# Altium schematic sheet Sheet3.SchDoc
size 420 x 297 mm
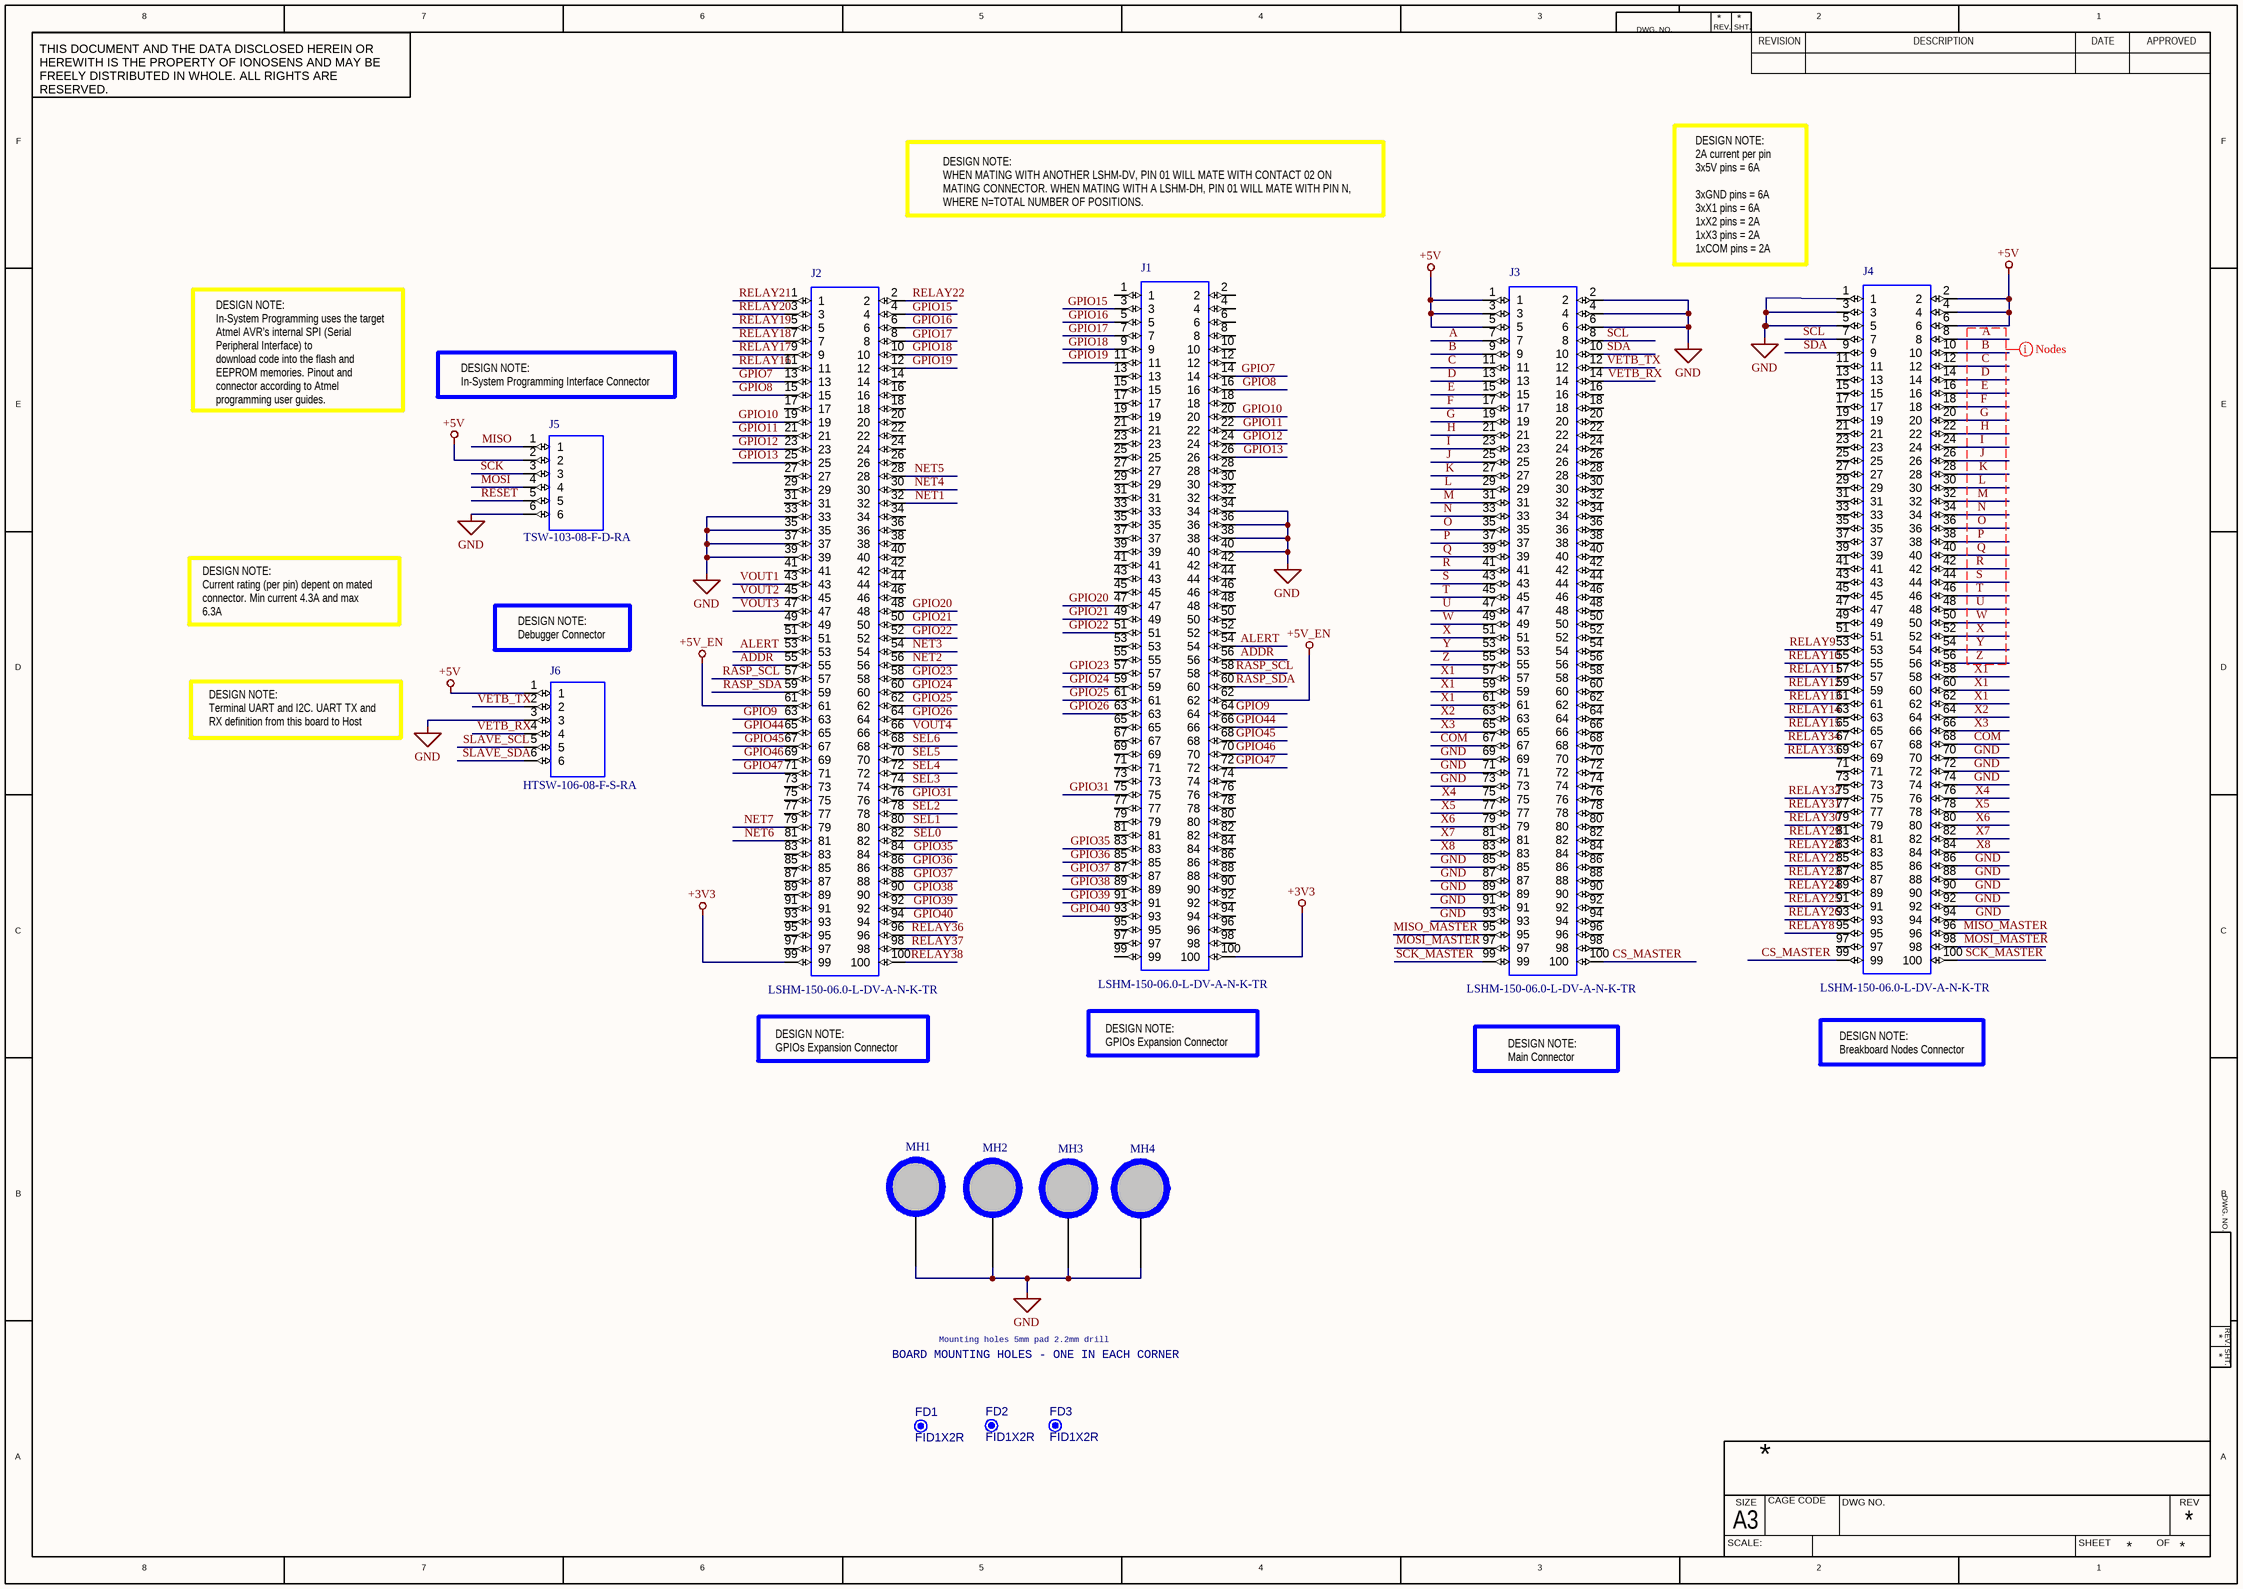
[diagram p0: Sheet3.SchDoc]

## Parts
FD1  FID1X2R  [FID1X2R]  (no BOM)
FD2  FID1X2R  [FID1X2R]  (no BOM)
FD3  FID1X2R  [FID1X2R]  (no BOM)
J1  LSHM-150-06.0-L-DV-A-N-K-TR  [LSHM_150_06_0_L_DV_A_N_K_TR]
J2  LSHM-150-06.0-L-DV-A-N-K-TR  [LSHM_150_06_0_L_DV_A_N_K_TR]
J3  LSHM-150-06.0-L-DV-A-N-K-TR  [LSHM_150_06_0_L_DV_A_N_K_TR]
J4  LSHM-150-06.0-L-DV-A-N-K-TR  [LSHM_150_06_0_L_DV_A_N_K_TR]
J5  TSW-103-08-F-D-RA  [TSW-103-08-F-D-RA]
J6  HTSW-106-08-F-S-RA  [TSW-106-08-F-S-RA]
MH1  C500h220  [C500h220z368]  (value not drawn)
MH2  C500h220  [C500h220z368]  (value not drawn)
MH3  C500h220  [C500h220z368]  (value not drawn)
MH4  C500h220  [C500h220z368]  (value not drawn)

## Nets
+3V3: J1.100 J2.99
+5V: J3.1 J3.3 J3.5 J4.2 J4.4 J4.6 J5.2 J6.1
+5V_EN: J1.62 J2.61
GND: J1.34 J1.36 J1.38 J1.40 J2.33 J2.35 J2.37 J2.39 J3.2 J3.4 J3.6 J3.69 J3.71 J3.73 J3.85 J3.87 J3.89 J3.91 J3.93 J4.1 J4.3 J4.5 J4.70 J4.72 J4.74 J4.86 J4.88 J4.90 J4.92 J4.94 J5.6 J6.3 MH1.1 MH2.1 MH3.1 MH4.1
A: J3.7 J4.8
ADDR: J1.56 J2.55
ALERT: J1.54 J2.53
B: J3.9 J4.10
C: J3.11 J4.12
COM: J3.67 J4.68
CS_MASTER: J3.100 J4.99
D: J3.13 J4.14
E: J3.15 J4.16
F: J3.17 J4.18
G: J3.19 J4.20
GPIO7: J1.14 J2.13
GPIO8: J1.16 J2.15
GPIO9: J1.64 J2.63
GPIO10: J1.20 J2.19
GPIO11: J1.22 J2.21
GPIO12: J1.24 J2.23
GPIO13: J1.26 J2.25
GPIO15: J1.3 J2.4
GPIO16: J1.5 J2.6
GPIO17: J1.7 J2.8
GPIO18: J1.9 J2.10
GPIO19: J1.11 J2.12
GPIO20: J1.47 J2.48
GPIO21: J1.49 J2.50
GPIO22: J1.51 J2.52
GPIO23: J1.57 J2.58
GPIO24: J1.59 J2.60
GPIO25: J1.61 J2.62
GPIO26: J1.63 J2.64
GPIO31: J1.75 J2.76
GPIO35: J1.83 J2.84
GPIO36: J1.85 J2.86
GPIO37: J1.87 J2.88
GPIO38: J1.89 J2.90
GPIO39: J1.91 J2.92
GPIO40: J1.93 J2.94
GPIO44: J1.66 J2.65
GPIO45: J1.68 J2.67
GPIO46: J1.70 J2.69
GPIO47: J1.72 J2.71
H: J3.21 J4.22
I: J3.23 J4.24
J: J3.25 J4.26
K: J3.27 J4.28
L: J3.29 J4.30
M: J3.31 J4.32
MISO: J5.1
MISO_MASTER: J3.95 J4.96
MOSI: J5.4
MOSI_MASTER: J3.97 J4.98
N: J3.33 J4.34
NET1: J2.32
NET2: J2.56
NET3: J2.54
NET4: J2.30
NET5: J2.28
NET6: J2.81
NET7: J2.79
O: J3.35 J4.36
P: J3.37 J4.38
Q: J3.39 J4.40
R: J3.41 J4.42
RASP_SCL: J1.58 J2.57
RASP_SDA: J1.60 J2.59
RELAY8: J4.95
RELAY9: J4.53
RELAY10: J4.55
RELAY11: J4.57
RELAY12: J4.59
RELAY13: J4.61
RELAY14: J4.63
RELAY15: J4.65
RELAY16: J2.11
RELAY17: J2.9
RELAY18: J2.7
RELAY19: J2.5
RELAY20: J2.3
RELAY21: J2.1
RELAY22: J2.2
RELAY23: J4.87
RELAY24: J4.89
RELAY25: J4.91
RELAY26: J4.93
RELAY27: J4.85
RELAY28: J4.83
RELAY29: J4.81
RELAY30: J4.79
RELAY31: J4.77
RELAY32: J4.75
RELAY33: J4.69
RELAY34: J4.67
RELAY36: J2.96
RELAY37: J2.98
RELAY38: J2.100
RESET: J5.5
S: J3.43 J4.44
SCK: J5.3
SCK_MASTER: J3.99 J4.100
SCL: J3.8 J4.7
SDA: J3.10 J4.9
SEL0: J2.82
SEL1: J2.80
SEL2: J2.78
SEL3: J2.74
SEL4: J2.72
SEL5: J2.70
SEL6: J2.68
SLAVE_SCL: J6.5
SLAVE_SDA: J6.6
T: J3.45 J4.46
U: J3.47 J4.48
VETB_RX: J3.14 J6.4
VETB_TX: J3.12 J6.2
VOUT1: J2.43
VOUT2: J2.45
VOUT3: J2.47
VOUT4: J2.66
W: J3.49 J4.50
X: J3.51 J4.52
X1: J3.57 J3.59 J3.61 J4.58 J4.60 J4.62
X2: J3.63 J4.64
X3: J3.65 J4.66
X4: J3.75 J4.76
X5: J3.77 J4.78
X6: J3.79 J4.80
X7: J3.81 J4.82
X8: J3.83 J4.84
Y: J3.53 J4.54
Z: J3.55 J4.56

Not connected (* = marked no-connect by the designer): J1 1 2 4 6 8 10 12 13 15 17 18 19 21 23 25 27 28 29 30 31 32 33 35 37 39 41 42 43 44 45 46 48 50 52 53 55 65 67 69 71 73 74 76 77 78 79 80 81 82 84 86 88 90 92 94 95 96 97 98 99; J2 14 16 17 18 20 22 24 26 27 29 31 34 36 38 40 41 42 44 46 49 51 73 75 77 83 85 87 89 91 93 95 97; J3 16 18 20 22 24 26 28 30 32 34 36 38 40 42 44 46 48 50 52 54 56 58 60 62 64 66 68 70 72 74 76 78 80 82 84 86 88 90 92 94 96 98; J4 11 13 15 17 19 21 23 25 27 29 31 33 35 37 39 41 43 45 47 49 51 71 73 97

## Layout directives
net class Nodes: A, B, C, D, E, F, G, H, I, J, K, L, M, N, O, P, Q, R, S, T, U, W, X, Y, Z

## Notes on the sheet
- DESIGN NOTE:
  WHEN MATING WITH ANOTHER LSHM-DV, PIN 01 WILL MATE WITH CONTACT 02 ON
  MATING CONNECTOR. WHEN MATING WITH A LSHM-DH, PIN 01 WILL MATE WITH PIN N,
  WHERE N=TOTAL NUMBER OF POSITIONS.
- DESIGN NOTE:
  2A current per pin
  3x5V pins = 6A
  3xGND pins = 6A
  3xX1 pins = 6A
  1xX2 pins = 2A
  1xX3 pins = 2A
  1xCOM pins = 2A
- DESIGN NOTE:
  In-System Programming Interface Connector
- DESIGN NOTE:
  In-System Programming uses the target Atmel AVR’s internal SPI (Serial Peripheral Interface) to
  download code into the flash and EEPROM memories. Pinout and connector according to Atmel programming user guides.
- DESIGN NOTE:
  Current rating (per pin) depent on mated connector. Min current 4.3A and max 6.3A
- (near J6) DESIGN NOTE:
  Debugger Connector
- DESIGN NOTE:
  Terminal UART and I2C. UART TX and RX definition from this board to Host
- DESIGN NOTE:
  GPIOs Expansion Connector
- DESIGN NOTE:
  Main Connector
- DESIGN NOTE:
  Breakboard Nodes Connector
- Mounting holes 5mm pad 2.2mm drill
- BOARD MOUNTING HOLES - ONE IN EACH CORNER
- 8
- 7
- 6
- 5
- 4
- 3
- DWG. NO.
- REV.
- SHT.
- REVISION
- 2
- DESCRIPTION
- DATE
- 1
- APPROVED
- THIS DOCUMENT AND THE DATA DISCLOSED HEREIN OR HEREWITH IS THE PROPERTY OF IONOSENS AND MAY BE FREELY DISTRIBUTED IN WHOLE. ALL RIGHTS ARE RESERVED.
- F
- E
- D
- C
- B
- A
- SCALE:
- A3
- SIZE
- CAGE CODE
- DWG NO.
- SHEET
- OF
- REV

## Library data of the parts
FD1-FD3 = CMP-00028-00005-2: Fiducial - Round 1x2mm; Pins: 0
J1-J4 = J01-001-01-00001-2: Conn Socket and Terminal Strip HDR/SKT 100 POS 0.5mm Solder ST SMD T/R; Manufacturer: Samtec; Gender: HERMAPHRODITIC; Pitch: 500 µm; Contact Plating: Gold; Case/Package: SMD; Max Operating Temperature: 125°C; Number of Rows: 2; RoHS Compliant: Yes; Housing Color: Black; Mounting Technology: SMD; Pins: 100; Termination: Solder; Orientation: Straight; Depth: 4.98 mm; Length: 29.7 mm; Contact Material: Bronze; Housing Material: Polymer; Min Operating Temperature: -55°C; Manufacturer P/N: LSHM-150-06.0-L-DV-A-N-K-TR
J5 = J01-001-01-00003-2: 6 Vias Pin Header 2.54mm, Right Angle; Manufacturer: Samtec; Gender: Male; RoHS Compliant: Yes; Min Operating Temperature: -55°C; Case/Package: Through Hole; Termination: Solder; Depth: 4.87 mm; Max Operating Temperature: 125°C; Housing Material: Polyester; Mounting Technology: Through Hole; Number of Rows: 2; Pitch: 2.54mm; Contact Plating: Gold; Contact Material: Bronze; Manufacturer P/N: TSW-103-08-F-D-RA; Pins: 6; Orientation: Straight; Length: 7.62 mm; Housing Color: Black
J6 = J01-001-01-00005-2: 6 Vias Pin Header 2.54mm, Right Angle, 1 Row; Manufacturer: Samtec; Gender: Male; Manufacturer P/N: HTSW-106-08-F-S-RA; Contact Plating: Gold; Length: 7.62 mm; Pins: 6; Housing Material: Polyester; Housing Color: Black; RoHS Compliant: Yes; Case/Package: Through Hole; Pitch: 2.54mm; Mounting Technology: Through Hole; Depth: 4.87 mm; Orientation: Straight; Number of Rows: 2; Contact Material: Bronze; Max Operating Temperature: 125°C; Min Operating Temperature: -55°C; Termination: Solder
MH1-MH4 = CMP-00028-00007-2: hole 5mm pad drill 2.2; Manufacturer: Ionosens; Manufacturer P/N: H5D22; Mounting Technology: Pad; RoHS Compliant: yes; Case/Package: Pad; Min Operating Temperature: 125°C; Pins: 1; Max Operating Temperature: -40°C